# EasyEDA schematic SCH_ultrasound_version2_2023-05-13.json
TITLE: jhz_ultrasound_imaging_version2.0; REV: 1.0; Date: 2023-05-01; Sheet: 1/1; Company: Your Company
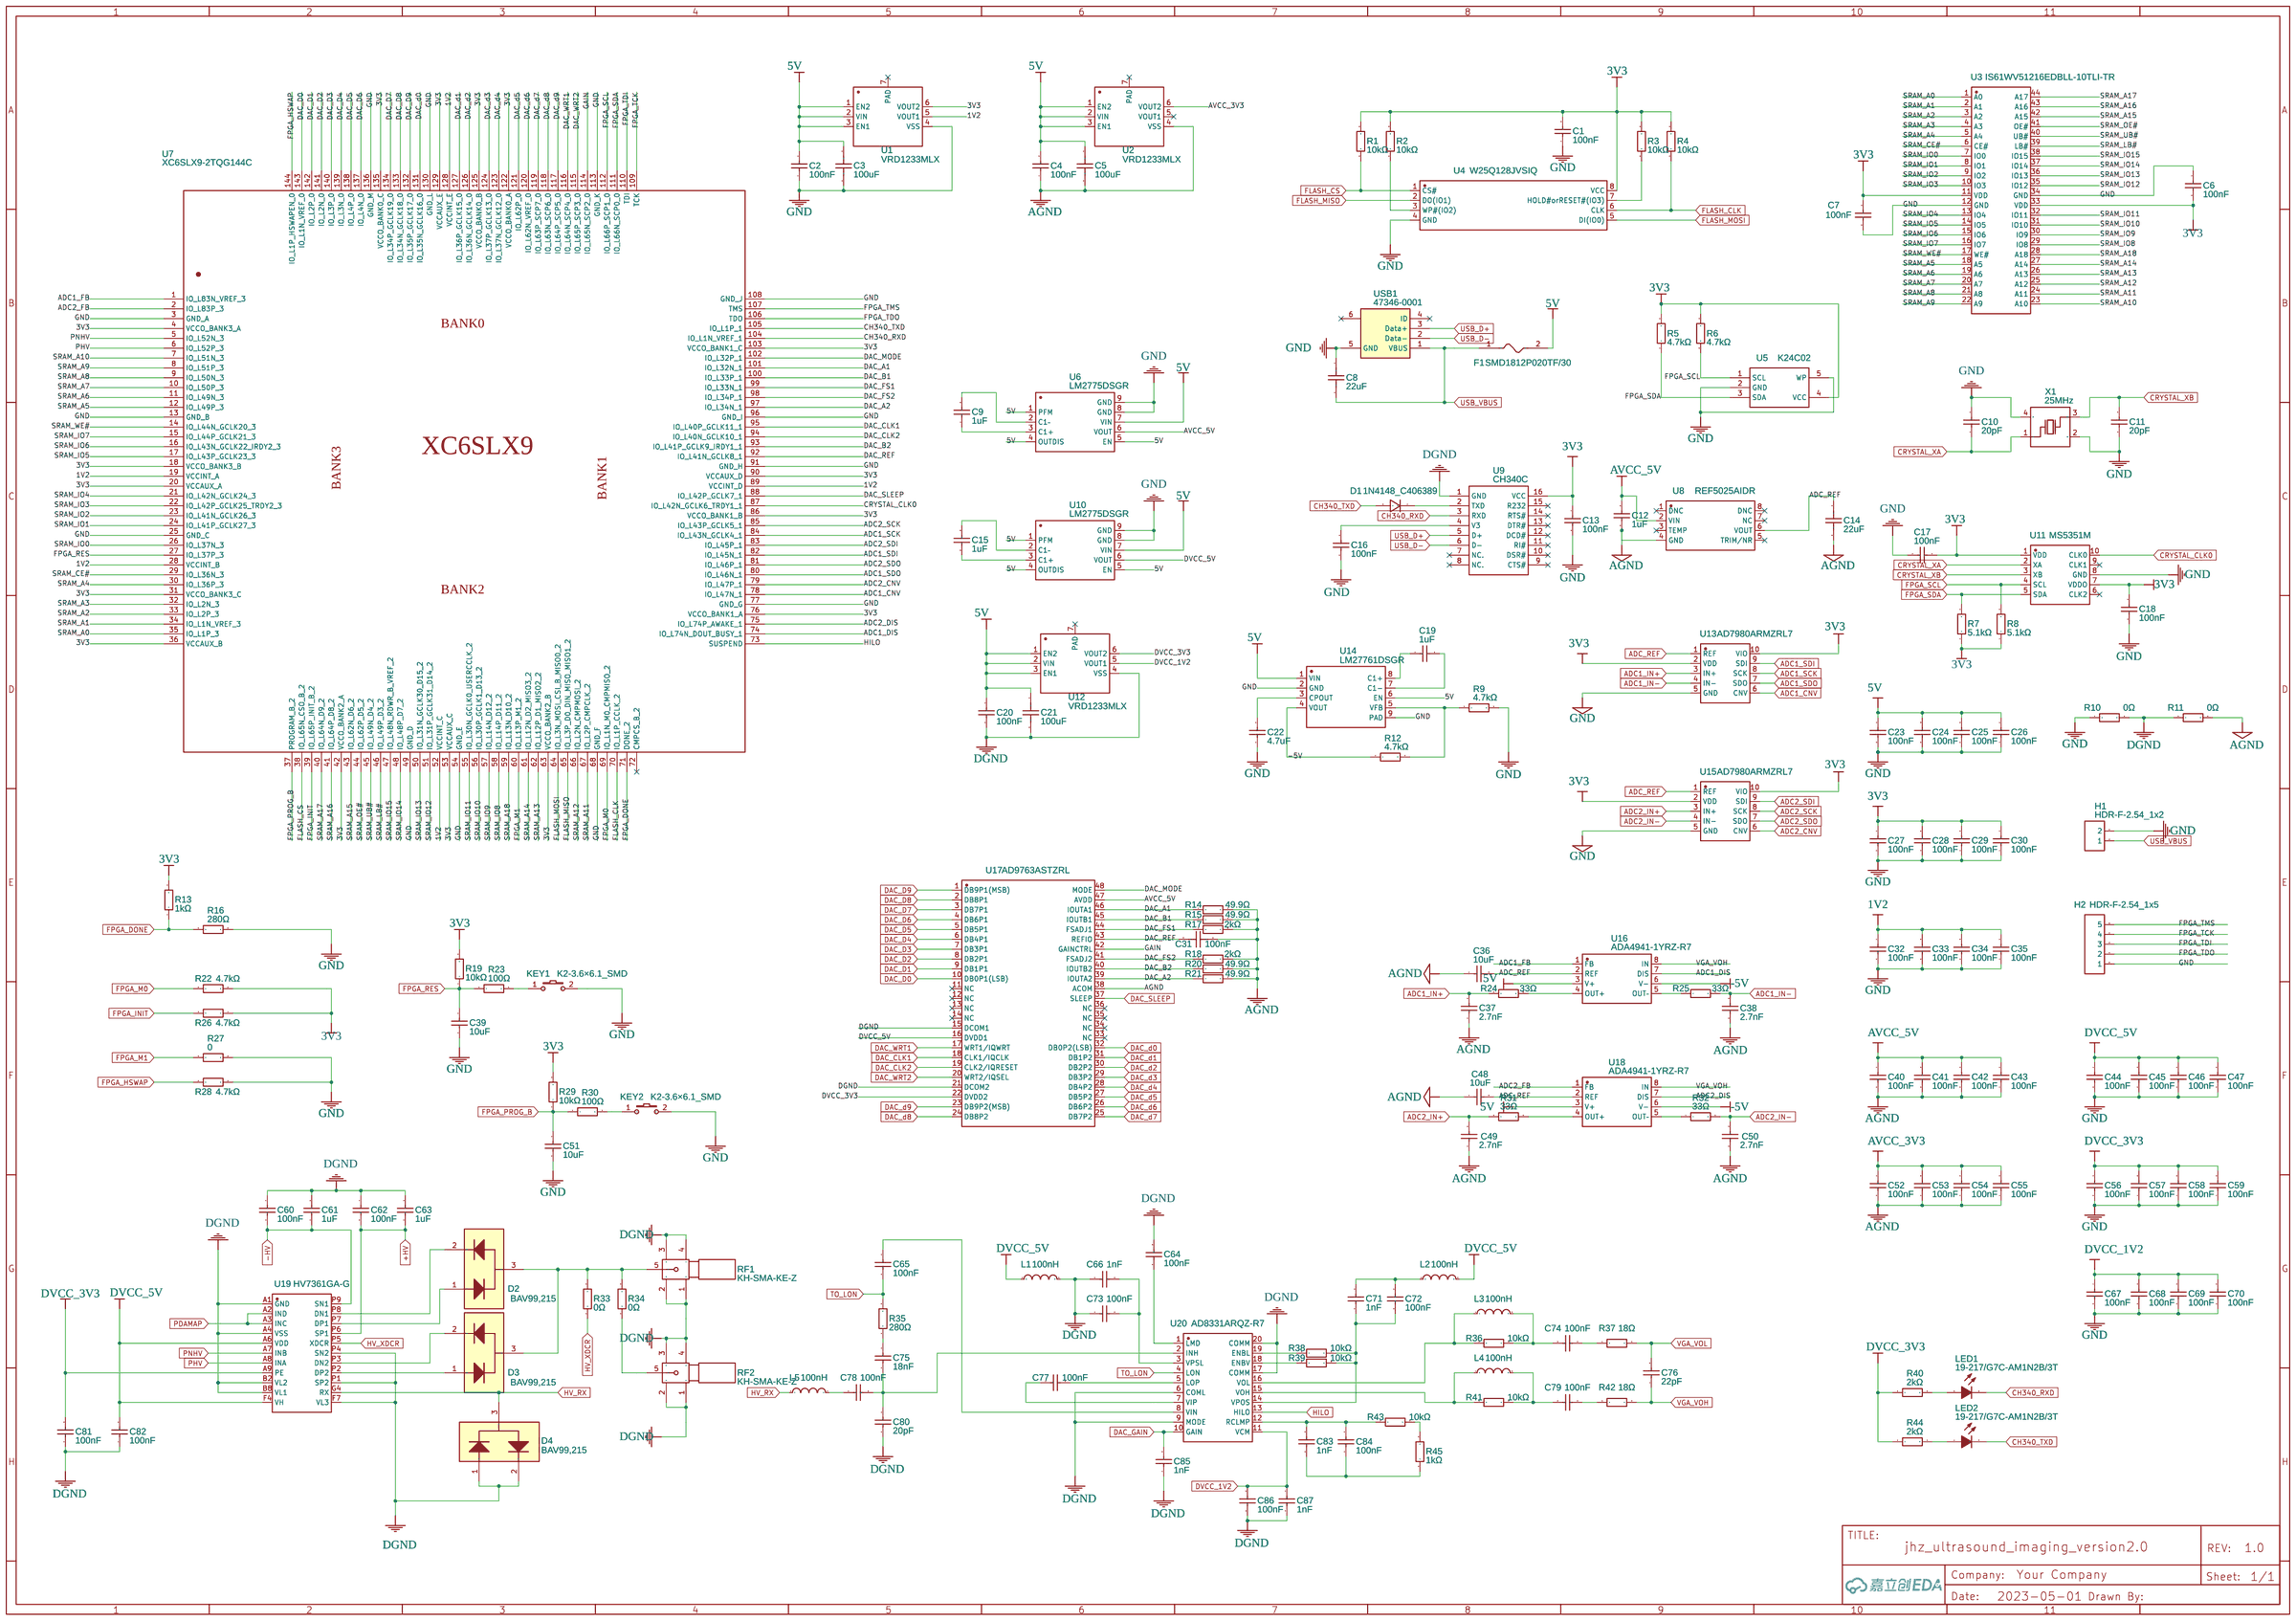
[diagram p0: schematic sheet]

## Parts
C1  100nF  [C0603]
C2  100nF  [C0603]
C3  100uF  [C1206]
C4  100nF  [C0603]
C5  100uF  [C1206]
C6  100nF  [C0603]
C7  100nF  [C0603]
C8  22uF  [C0805]
C9  1uF  [C0603]
C10  20pF  [C0402]
C11  20pF  [C0402]
C12  1uF  [C0603]
C13  100nF  [C0603]
C14  22uF  [C0805]
C15  1uF  [C0603]
C16  100nF  [C0603]
C17  100nF  [C0603]
C18  100nF  [C0603]
C19  1uF  [C0603]
C20  100nF  [C0603]
C21  100uF  [C1206]
C22  4.7uF  [C1206]
C23  100nF  [C0603]
C24  100nF  [C0603]
C25  100nF  [C0603]
C26  100nF  [C0603]
C27  100nF  [C0603]
C28  100nF  [C0603]
C29  100nF  [C0603]
C30  100nF  [C0603]
C31  100nF  [C0603]
C32  100nF  [C0603]
C33  100nF  [C0603]
C34  100nF  [C0603]
C35  100nF  [C0603]
C36  10uF  [C0805]
C37  2.7nF  [C0603]
C38  2.7nF  [C0603]
C39  10uF  [C0805]
C40  100nF  [C0603]
C41  100nF  [C0603]
C42  100nF  [C0603]
C43  100nF  [C0603]
C44  100nF  [C0603]
C45  100nF  [C0603]
C46  100nF  [C0603]
C47  100nF  [C0603]
C48  10uF  [C0805]
C49  2.7nF  [C0603]
C50  2.7nF  [C0603]
C51  10uF  [C0805]
C52  100nF  [C0603]
C53  100nF  [C0603]
C54  100nF  [C0603]
C55  100nF  [C0603]
C56  100nF  [C0603]
C57  100nF  [C0603]
C58  100nF  [C0603]
C59  100nF  [C0603]
C60  100nF  [C0603]
C61  1uF  [C0603]
C62  100nF  [C0603]
C63  1uF  [C0603]
C64  100nF  [C0603]
C65  100nF  [C0603]
C66  1nF  [C1206]
C67  100nF  [C0603]
C68  100nF  [C0603]
C69  100nF  [C0603]
C70  100nF  [C0603]
C71  1nF  [C1206]
C72  100nF  [C0603]
C73  100nF  [C0603]
C74  100nF  [C0603]
C75  18nF  [C0805]
C76  22pF  [C0402]
C77  100nF  [C0603]
C78  100nF  [C0603]
C79  100nF  [C0603]
C80  20pF  [C0402]
C81  100nF  [C0603]
C82  100nF  [C0603]
C83  1nF  [C1206]
C84  100nF  [C0603]
C85  1nF  [C1206]
C86  100nF  [C0603]
C87  1nF  [C1206]
D1  1N4148_C406389  [DO-35_BD2.0-L4.2-P8.20-D0.5-RD]
D2  BAV99,215  [SOT-23-3_L2.9-W1.6-P1.90-LS2.8-BR]
D3  BAV99,215  [SOT-23-3_L2.9-W1.6-P1.90-LS2.8-BR]
D4  BAV99,215  [SOT-23-3_L2.9-W1.6-P1.90-LS2.8-BR]
F1  SMD1812P020TF/30  [F1812]
H1  HDR-F-2.54_1x2  [HDR-F-2.54_1X2]
H2  HDR-F-2.54_1x5  [HDR-F-2.54_1X5]
KEY1  K2-3.6×6.1_SMD  [KEY-SMD_2P-L6.2-W3.6-LS8.0]
KEY2  K2-3.6×6.1_SMD  [KEY-SMD_2P-L6.2-W3.6-LS8.0]
L1  100nH  [L0603]
L2  100nH  [L0603]
L3  100nH  [L0603]
L4  100nH  [L0603]
L5  100nH  [L0603]
LED1  19-217/G7C-AM1N2B/3T  [LED0603-R-RD]
LED2  19-217/G7C-AM1N2B/3T  [LED0603-R-RD]
R1  10kΩ  [R0603]
R2  10kΩ  [R0603]
R3  10kΩ  [R0603]
R4  10kΩ  [R0603]
R5  4.7kΩ  [R0603]
R6  4.7kΩ  [R0603]
R7  5.1kΩ  [R0603]
R8  5.1kΩ  [R0603]
R9  4.7kΩ  [R0603]
R10  0Ω  [R0603]
R11  0Ω  [R0603]
R12  4.7kΩ  [R0603]
R13  1kΩ  [R0603]
R14  49.9Ω  [R0402]
R15  49.9Ω  [R0402]
R16  280Ω  [R0402]
R17  2kΩ  [R0603]
R18  2kΩ  [R0603]
R19  10kΩ  [R0603]
R20  49.9Ω  [R0402]
R21  49.9Ω  [R0402]
R22  4.7kΩ  [R0603]
R23  100Ω  [R0603]
R24  33Ω  [R0402]
R25  33Ω  [R0402]
R26  4.7kΩ  [R0603]
R27  0  [R0603]
R28  4.7kΩ  [R0603]
R29  10kΩ  [R0603]
R30  100Ω  [R0603]
R31  33Ω  [R0402]
R32  33Ω  [R0402]
R33  0Ω  [R0603]
R34  0Ω  [R0603]
R35  280Ω  [R0402]
R36  10kΩ  [R0603]
R37  18Ω  [R0603]
R38  10kΩ  [R0603]
R39  10kΩ  [R0603]
R40  2kΩ  [R0603]
R41  10kΩ  [R0603]
R42  18Ω  [R0603]
R43  10kΩ  [R0603]
R44  2kΩ  [R0603]
R45  1kΩ  [R0603]
RF1  KH-SMA-KE-Z  [SMA-TH_KH-SMA-KE-Z]
RF2  KH-SMA-KE-Z  [SMA-TH_KH-SMA-KE-Z]
U1  VRD1233MLX  [LLP-6_L2.0-W1.8-P0.50-BL-EP]
U2  VRD1233MLX  [LLP-6_L2.0-W1.8-P0.50-BL-EP]
U3  IS61WV51216EDBLL-10TLI-TR  [TSOP-44_L18.4-W10.2-P0.80-LS11.8-BL]
U4  W25Q128JVSIQ  [SOIC-8_L5.3-W5.3-P1.27-LS8.0-BL]
U5  K24C02  [SOT-23-5_L3.0-W1.7-P0.95-LS2.8-BR]
U6  LM2775DSGR  [WSON-8_L2.0-W2.0-P0.50-TL-EP]
U7  XC6SLX9-2TQG144C  [LQFP-144_L20.0-W20.0-P0.50-LS22.0-BL]
U8  REF5025AIDR  [SOIC-8_L4.9-W3.9-P1.27-LS6.0-BL]
U9  CH340C  [SOP-16_L10.0-W3.9-P1.27-LS6.0-BL]
U10  LM2775DSGR  [WSON-8_L2.0-W2.0-P0.50-TL-EP]
U11  MS5351M  [MSOP-10_L3.0-W3.0-P0.50-LS5.0-BL]
U12  VRD1233MLX  [LLP-6_L2.0-W1.8-P0.50-BL-EP]
U13  AD7980ARMZRL7  [MSOP-10_L3.0-W3.0-P0.50-LS5.0-BL]
U14  LM27761DSGR  [WSON-8_L2.0-W2.0-P0.65-BL-EP]
U15  AD7980ARMZRL7  [MSOP-10_L3.0-W3.0-P0.50-LS5.0-BL]
U16  ADA4941-1YRZ-R7  [SOIC-8_L4.9-W3.9-P1.27-LS6.0-BL]
U17  AD9763ASTZRL  [LQFP-48_L7.0-W7.0-P0.50-LS9.0-BL]
U18  ADA4941-1YRZ-R7  [SOIC-8_L4.9-W3.9-P1.27-LS6.0-BL]
U19  HV7361GA-G  [CABGA-22_L5.0-W7.0-TL-HV7361GA-G]
U20  AD8331ARQZ-R7  [QSOP-20_L8.7-W3.9-P0.64-LS6.0-BL]
USB1  47346-0001  [MICRO-USB-SMD_47346-0001]
X1  25MHz  [OSC-SMD_4P-L3.2-W2.5-BL]

## Library data of the parts
C1 C2 C4 C6 C7 C13 C16-C18 C20 C23-C30 C32-C35 C40-C47 C52-C60 C62 C64 C65 C67-C70 C72-C74 C77-C79 C81 C82 C84 C86 = 0603B104K500NT: Supplier: LCSC; Manufacturer: FH(风华); Supplier Part: C30926; JLCPCB Part Class: Extended Part
C3 C5 C21 = 1206X107M6R3NT: Supplier: LCSC; Manufacturer: FH(风华); Contributor: LCSC; Supplier Part: C178304; JLCPCB Part Class: Extended Part
C8 C14 = 0805X226M160NT: Supplier: LCSC; Manufacturer: FH(风华); Contributor: LCSC; Supplier Part: C129302; JLCPCB Part Class: Extended Part
C9 C12 C15 C19 C61 C63 = 0603B105K250NT: Supplier: LCSC; Manufacturer: FH(风华); Supplier Part: C59302; JLCPCB Part Class: Extended Part
C10 C11 C80 = 0402CG200J500NT: Supplier: LCSC; Manufacturer: FH(风华); Supplier Part: C1554; JLCPCB Part Class: Basic Part
C22 = 1206B475K500NT: Supplier: LCSC; Manufacturer: FH(风华); Supplier Part: C29823; JLCPCB Part Class: Basic Part
C31 = C0603B104K500NT: Supplier: LCSC; Supplier Part: C478888; Manufacturer: TORCH(火炬); Contributor: LCSC; JLCPCB Part Class: Extended Part
C36 C39 C48 C51 = 0805X106K250NT: Supplier: LCSC; Manufacturer: FH(风华); Supplier Part: C40894; JLCPCB Part Class: Extended Part
C37 C38 C49 C50 = 0603B272K500NT: Supplier: LCSC; Manufacturer: FH(风华); Supplier Part: C1609; JLCPCB Part Class: Basic Part
C66 C71 C83 C85 C87 = 1206B102K202NT: Supplier: LCSC; Manufacturer: FH(风华); Supplier Part: C9196; JLCPCB Part Class: Basic Part
C75 = 0805B183K500NT: Supplier: LCSC; Manufacturer: FH(风华); Supplier Part: C1723; JLCPCB Part Class: Extended Part
C76 = 0402CG220J500NT: Supplier: LCSC; Manufacturer: FH(风华); Supplier Part: C1555; JLCPCB Part Class: Basic Part
D1 = 1N4148_C406389: Supplier: LCSC; Supplier Part: C406389; Manufacturer: GOOD-ARK(固锝); Manufacturer Part: 1N4148; Contributor: LCSC; JLCPCB Part Class: Extended Part
D2-D4 = BAV99,215: Supplier: LCSC; Manufacturer: Nexperia(安世); Supplier Part: C2500; JLCPCB Part Class: Basic Part
F1 = SMD1812P020TF/30: Supplier: LCSC; Manufacturer: RUILON(瑞隆源); Supplier Part: C13575; JLCPCB Part Class: Extended Part
H1 = HDR-F-2.54_1x2: Supplier Part: C49661; Supplier: LCSC; Contributor: LCEDA_Lib
H2 = HDR-F-2.54_1x5: Supplier Part: C50950; Supplier: LCSC; Contributor: LCEDA_Lib
KEY1 KEY2 = K2-3.6×6.1_SMD: Supplier Part: C118141; Supplier: LCSC; Manufacturer Part: K2-1107ST-A4SW-06; Contributor: LCEDA_Lib; 制造商: 韩国韩荣
L1-L5 = VHF160808HR10JT: Supplier: LCSC; Manufacturer: FH(风华); Supplier Part: C90214; JLCPCB Part Class: Extended Part
LED1 LED2 = 19-217/G7C-AM1N2B/3T: Supplier: LCSC; Supplier Part: C183844; Manufacturer: EVERLIGHT(亿光); Contributor: LCSC; JLCPCB Part Class: Extended Part
R1-R4 R19 R29 R36 R38 R39 R41 R43 = RS-03K1002FT: Supplier: LCSC; Supplier Part: C115324; Manufacturer: FH(风华); Resistance (Ohms): 10K; Contributor: LCSC; JLCPCB Part Class: Extended Part
R5 R6 R9 R12 R22 R26 R28 = RS-03K4701FT: Supplier: LCSC; Manufacturer: FH(风华); Resistance (Ohms): 4.7K; Contributor: LCSC; Supplier Part: C116693; JLCPCB Part Class: Extended Part
R7 R8 = RS-03K5101FT: Supplier: LCSC; Supplier Part: C156350; Manufacturer: FH(风华); Resistance (Ohms): 5.1K; Contributor: LCSC; JLCPCB Part Class: Extended Part
R10 R11 = RS-03000JT_C115304: Supplier: LCSC; Supplier Part: C115304; Manufacturer: FH(风华); Manufacturer Part: RS-03000JT; Resistance (Ohms): 0; Contributor: LCSC; JLCPCB Part Class: Extended Part; Package Display: No
R13 R45 = RS-03K1001FT: Supplier: LCSC; Manufacturer: FH(风华); Supplier Part: C115325; Resistance (Ohms): 1K; JLCPCB Part Class: Extended Part
R14 R15 R20 R21 = RC-02W49R9FT: Supplier: LCSC; Supplier Part: C258106; Manufacturer: FH(风华); Resistance (Ohms): 49.9; Contributor: LCSC; JLCPCB Part Class: Extended Part
R16 R35 = RC-02W2800FT: Supplier: LCSC; Supplier Part: C321421; Manufacturer: FH(风华); Resistance (Ohms): 280; Contributor: LCSC; JLCPCB Part Class: Extended Part
R17 R18 R40 R44 = RS-03K2001FT: Supplier: LCSC; Manufacturer: FH(风华); Supplier Part: C115336; Resistance (Ohms): 2K; JLCPCB Part Class: Extended Part
R23 R30 = RS-03K101JT: Supplier: LCSC; Manufacturer: FH(风华); Supplier Part: C86983; Resistance (Ohms): 100; JLCPCB Part Class: Extended Part
R24 R25 R31 R32 = RC-02W33R0FT: Supplier: LCSC; Supplier Part: C140161; Manufacturer: FH(风华); Resistance (Ohms): 33; Contributor: LCSC; JLCPCB Part Class: Extended Part
R27 = RS-03000JT: Supplier: LCSC; Manufacturer: FH; Supplier Part: C73810; JLCPCB Part Class: Extended Part
R33 R34 = RS-03000JT_C115304: Supplier: LCSC; Supplier Part: C115304; Manufacturer: FH(风华); Manufacturer Part: RS-03000JT; Resistance (Ohms): 0; Contributor: LCSC; JLCPCB Part Class: Extended Part
R37 R42 = RS-03K180JT: Supplier: LCSC; Supplier Part: C286576; Manufacturer: FH(风华); Resistance (Ohms): 18; Contributor: LCSC; JLCPCB Part Class: Extended Part
RF1 RF2 = KH-SMA-KE-Z: Supplier: LCSC; Supplier Part: C504007; Manufacturer: Shenzhen Kinghelm Elec; Contributor: LCSC; JLCPCB Part Class: Extended Part
U1 U2 U12 = VRD1233MLX: Supplier: LCSC; Supplier Part: C697903; Manufacturer: AnaSem(安纳森); Contributor: LCSC; JLCPCB Part Class: Extended Part
U3 = IS61WV51216EDBLL-10TLI-TR: Supplier: LCSC; Supplier Part: C2065273; Manufacturer: ISSI(美国芯成); Contributor: LCSC; JLCPCB Part Class: Extended Part
U4 = W25Q128JVSIQ: Supplier: LCSC; Supplier Part: C113767; Manufacturer: WINBOND(华邦); Contributor: LCSC; JLCPCB Part Class: Extended Part
U5 = K24C02: Supplier: LCSC; Manufacturer: 华虹宏力; Supplier Part: C84964; JLCPCB Part Class: Extended Part
U6 U10 = LM2775DSGR: Supplier: LCSC; Supplier Part: C473361; Manufacturer: TI(德州仪器); Contributor: LCSC; JLCPCB Part Class: Extended Part
U7 = XC6SLX9-2TQG144C: Supplier: LCSC; Manufacturer: XILINX(赛灵思); Supplier Part: C27408; JLCPCB Part Class: Extended Part
U8 = REF5025AIDR: tags: Voltage Reference; Supplier Part: C11341; Supplier: LCSC; Manufacturer: TI(德州仪器); subpart_no: 2; JLCPCB Part Class: Extended Part
U9 = CH340C: Supplier: LCSC; Manufacturer: WCH(南京沁恒); Supplier Part: C84681; JLCPCB Part Class: Extended Part
U11 = MS5351M: Supplier: LCSC; Supplier Part: C1509083; Manufacturer: 杭州瑞盟; Contributor: LCSC; JLCPCB Part Class: Extended Part
U13 U15 = AD7980ARMZRL7: Supplier: LCSC; Supplier Part: C578576; Manufacturer: ADI(亚德诺)/LINEAR(凌特); Contributor: LCSC; JLCPCB Part Class: Extended Part
U14 = LM27761DSGR: Supplier: LCSC; Manufacturer: TI(德州仪器); Supplier Part: C129351; JLCPCB Part Class: Extended Part
U16 U18 = ADA4941-1YRZ-R7: Supplier: LCSC; Supplier Part: C495334; Manufacturer: ADI(亚德诺)/LINEAR(凌特); Contributor: LCSC; JLCPCB Part Class: Extended Part
U17 = AD9763ASTZRL: Supplier: LCSC; Supplier Part: C481891; Manufacturer: ADI(亚德诺)/LINEAR(凌特); Contributor: LCSC; JLCPCB Part Class: Extended Part
U19 = HV7361GA-G: Supplier: LCSC; Supplier Part: C633420; Manufacturer: MICROCHIP(美国微芯); Contributor: LCSC; JLCPCB Part Class: Extended Part
U20 = AD8331ARQZ-R7: Supplier: LCSC; Supplier Part: C578697; Manufacturer: ADI(亚德诺)/LINEAR(凌特); Contributor: LCSC; JLCPCB Part Class: Extended Part
USB1 = 47346-0001: Supplier: LCSC; Supplier Part: C132560; Manufacturer: MOLEX; Manufacturer Part: 473460001; Contributor: LCSC; JLCPCB Part Class: Extended Part
X1 = X322525MOB4SI: Supplier: LCSC; Manufacturer: YXC(扬兴晶振); Supplier Part: C9006; JLCPCB Part Class: Basic Part

## Nets
1V2: C32.1 C33.2 C34.2 C35.2 U1.5(VOUT1) U7.19(VCCINT_A) U7.28(VCCINT_B) U7.52(VCCINT_C) U7.89(VCCINT_D) U7.128(VCCINT_E)
3V3: C1.2 C6.2 C7.2 C13.1 C17.2 C18.2 C27.1 C28.2 C29.2 C30.2 R1.2 R2.2 R3.2 R4.2 R5.2 R6.2 R7.1 R8.1 R13.2 R19.2 R22.2 R26.1 R29.2 U1.6(VOUT2) U3.11(VDD) U3.33(VDD) U4.8(VCC) U5.4(VCC) U7.4(VCCO_BANK3_A) U7.18(VCCO_BANK3_B) U7.20(VCCAUX_A) U7.31(VCCO_BANK3_C) U7.36(VCCAUX_B) U7.42(VCCO_BANK2_A) U7.53(VCCAUX_C) U7.63(VCCO_BANK2_B) U7.76(VCCO_BANK1_A) U7.86(VCCO_BANK1_B) U7.90(VCCAUX_D) U7.103(VCCO_BANK1_C) U7.122(VCCO_BANK0_A) U7.125(VCCO_BANK0_B) U7.129(VCCAUX_E) U7.135(VCCO_BANK0_C) U9.16(VCC) U11.1(VDD) U11.7(VDDO) U13.2(VDD) U13.10(VIO) U15.2(VDD) U15.10(VIO)
5V: C2.2 C3.1 C4.2 C5.1 C20.2 C21.1 C23.1 C24.2 C25.2 C26.2 F1.2 U1.1(EN2) U1.2(VIN) U1.3(EN1) U2.1(EN2) U2.2(VIN) U2.3(EN1) U6.1(PFM) U6.4(OUTDIS) U6.5(EN) U6.7(VIN) U10.1(PFM) U10.4(OUTDIS) U10.5(EN) U10.7(VIN) U12.1(EN2) U12.2(VIN) U12.3(EN1) U14.1(VIN) U14.6(EN) U16.3(V+) U18.3(V+)
-5V: R12.1 U14.4(VOUT) U16.6(V-) U18.6(V-)
AGND: C4.1 C5.2 C12.1 C14.2 C31.2 C36.1 C37.1 C38.1 C40.2 C41.1 C42.1 C43.1 C48.1 C49.1 C50.1 C52.2 C53.1 C54.1 C55.1 R11.2 R14.2 R15.2 R17.2 R18.2 R20.2 R21.2 U2.4(VSS) U8.4(GND) U17.38(ACOM)
AVCC_3V3: C52.1 C53.2 C54.2 C55.2 U2.6(VOUT2)
AVCC_5V: C12.2 C40.1 C41.2 C42.2 C43.2 U6.6(VOUT) U8.2(VIN) U17.47(AVDD)
DGND: C20.1 C21.2 C60.1 C61.2 C62.1 C63.2 C64.2 C66.1 C73.1 C80.1 C81.1 C82.1 C85.1 C86.2 C87.2 D4.1 D4.2 L1.2 R10.2 R11.1 RF1.1 RF1.2 RF1.3 RF1.4 RF2.1 RF2.2 RF2.3 RF2.4 U9.1(GND) U12.4(VSS) U17.15(DCOM1) U17.21(DCOM2) U19.A1(GND) U19.A4(VSS) U19.B2(VL2) U19.B8(VL1) U19.F7(VL3) U19.P1(SP2) U19.P4(SN2) U20.6(COML) U20.9(MODE) U20.17(COMM) U20.20(COMM)
DVCC_1V2: C67.1 C68.2 C69.2 C70.2 C86.1 C87.1 U12.5(VOUT1) U20.11(VCM)
DVCC_3V3: C56.1 C57.2 C58.2 C59.2 C81.2 R40.1 R44.1 U12.6(VOUT2) U17.22(DVDD2) U19.A9(PE)
DVCC_5V: C44.1 C45.2 C46.2 C47.2 C82.2 L1.1 L2.2 U10.6(VOUT) U17.16(DVDD1) U19.A6(VDD) U19.F4(VH)
GND: C1.1 C2.1 C3.2 C6.1 C7.1 C8.1 C10.2 C11.1 C13.2 C16.2 C17.1 C18.1 C22.1 C23.2 C24.1 C25.1 C26.1 C27.2 C28.1 C29.1 C30.1 C32.2 C33.1 C34.1 C35.1 C39.1 C44.2 C45.1 C46.1 C47.1 C51.1 C56.2 C57.1 C58.1 C59.1 C67.2 C68.1 C69.1 C70.1 H1.2 H2.1 KEY1.2 KEY2.2 R9.2 R10.1 R16.2 R27.2 R28.1 U1.4(VSS) U3.12(GND) U3.34(GND) U4.4(GND) U5.2(GND) U5.5(WP) U6.8(GND) U6.9(GND) U7.3(GND_A) U7.13(GND_B) U7.25(GND_C) U7.49(GND_D) U7.54(GND_E) U7.68(GND_F) U7.77(GND_G) U7.91(GND_H) U7.96(GND_I) U7.108(GND_J) U7.113(GND_K) U7.130(GND_L) U7.136(GND_M) U10.8(GND) U10.9(GND) U11.8(GND) U13.5(GND) U14.2(GND) U14.9(PAD) U15.5(GND) USB1.5(GND) X1.2(GND) X1.4(GND)
+HV: C62.2 C63.1 U19.P6(SP1)
-HV: C60.2 C61.1 U19.P9(SN1)
ADC1_CNV: U7.78(IO_L47N_1) U13.6(CNV)
ADC1_DIS: U7.74(IO_L74N_DOUT_BUSY_1) U16.7(DIS)
ADC1_FB: U7.1(IO_L83N_VREF_3) U16.1(FB)
ADC1_IN+: C37.2 R24.1 U13.3(IN+)
ADC1_IN-: C38.2 R25.2 U13.4(IN-)
ADC1_SCK: U7.84(IO_L43N_GCLK4_1) U13.8(SCK)
ADC1_SDI: U7.82(IO_L45N_1) U13.9(SDI)
ADC1_SDO: U7.80(IO_L46N_1) U13.7(SDO)
ADC2_CNV: U7.79(IO_L47P_1) U15.6(CNV)
ADC2_DIS: U7.75(IO_L74P_AWAKE_1) U18.7(DIS)
ADC2_FB: U7.2(IO_L83P_3) U18.1(FB)
ADC2_IN+: C49.2 R31.1 U15.3(IN+)
ADC2_IN-: C50.2 R32.2 U15.4(IN-)
ADC2_SCK: U7.85(IO_L43P_GCLK5_1) U15.8(SCK)
ADC2_SDI: U7.83(IO_L45P_1) U15.9(SDI)
ADC2_SDO: U7.81(IO_L46P_1) U15.7(SDO)
ADC_REF: C14.1 C36.2 C48.2 U8.6(VOUT) U13.1(REF) U15.1(REF) U16.2(REF) U18.2(REF)
CH340_RXD: LED1.2(C) U7.104(IO_L1N_VREF_1) U9.3(RXD)
CH340_TXD: D1.2(A) LED2.2(C) U7.105(IO_L1P_1)
CRYSTAL_CLK0: U7.87(IO_L42N_GCLK6_TRDY1_1) U11.10(CLK0)
CRYSTAL_XA: C10.1 U11.2(XA) X1.1(OSC1)
CRYSTAL_XB: C11.2 U11.3(XB) X1.3(OSC2)
DAC_A1: R14.1 U7.101(IO_L32N_1) U17.46(IOUTA1)
DAC_A2: R21.1 U7.97(IO_L34N_1) U17.39(IOUTA2)
DAC_B1: R15.1 U7.100(IO_L33P_1) U17.45(IOUTB1)
DAC_B2: R20.1 U7.93(IO_L41P_GCLK9_IRDY1_1) U17.40(IOUTB2)
DAC_CLK1: U7.95(IO_L40P_GCLK11_1) U17.18(CLK1/IQCLK)
DAC_CLK2: U7.94(IO_L40N_GCLK10_1) U17.19(CLK2/IQRESET)
DAC_d0: U7.131(IO_L35N_GCLK16_0) U17.32(DB0P2(LSB))
DAC_D0: U7.143(IO_L1N_VREF_0) U17.10(DB0P1(LSB))
DAC_d1: U7.127(IO_L36P_GCLK15_0) U17.31(DB1P2)
DAC_D1: U7.142(IO_L2P_0) U17.9(DB1P1)
DAC_d2: U7.126(IO_L36N_GCLK14_0) U17.30(DB2P2)
DAC_D2: U7.141(IO_L2N_0) U17.8(DB2P1)
DAC_d3: U7.124(IO_L37P_GCLK13_0) U17.29(DB3P2)
DAC_D3: U7.140(IO_L3P_0) U17.7(DB3P1)
DAC_d4: U7.123(IO_L37N_GCLK12_0) U17.28(DB4P2)
DAC_D4: U7.139(IO_L3N_0) U17.6(DB4P1)
DAC_d5: U7.121(IO_L62P_0) U17.27(DB5P2)
DAC_D5: U7.138(IO_L4P_0) U17.5(DB5P1)
DAC_d6: U7.120(IO_L62N_VREF_0) U17.26(DB6P2)
DAC_D6: U7.137(IO_L4N_0) U17.4(DB6P1)
DAC_d7: U7.119(IO_L63P_SCP7_0) U17.25(DB7P2)
DAC_D7: U7.134(IO_L34P_GCLK19_0) U17.3(DB7P1)
DAC_d8: U7.118(IO_L63N_SCP6_0) U17.24(DB8P2)
DAC_D8: U7.133(IO_L34N_GCLK18_0) U17.2(DB8P1)
DAC_d9: U7.117(IO_L64P_SCP5_0) U17.23(DB9P2(MSB))
DAC_D9: U7.132(IO_L35P_GCLK17_0) U17.1(DB9P1(MSB))
DAC_FS1: R17.1 U7.99(IO_L33N_1) U17.44(FSADJ1)
DAC_FS2: R18.1 U7.98(IO_L34P_1) U17.41(FSADJ2)
DAC_GAIN: C85.2 U20.10(GAIN)
DAC_MODE: U7.102(IO_L32P_1) U17.48(MODE)
DAC_REF: C31.1 U7.92(IO_L41N_GCLK8_1) U17.43(REFIO)
DAC_SLEEP: U7.88(IO_L42P_GCLK7_1) U17.37(SLEEP)
DAC_WRT1: U7.116(IO_L64N_SCP4_0) U17.17(WRT1/IQWRT)
DAC_WRT2: U7.115(IO_L65P_SCP3_0) U17.20(WRT2/IQSEL)
FLASH_CLK: R4.1 U4.6(CLK) U7.70(IO_L1P_CCLK_2)
FLASH_CS: R1.1 U4.1(CS#) U7.38(IO_L65N_CSO_B_2)
FLASH_MISO: U4.2(DO(IO1)) U7.65(IO_L3P_D0_DIN_MISO_MISO1_2)
FLASH_MOSI: U4.5(DI(IO0)) U7.64(IO_L3N_MOSI_CSI_B_MISO0_2)
FPGA_DONE: R13.1 R16.1 U7.71(DONE_2)
FPGA_HSWAP: R28.2 U7.144(IO_L1P_HSWAPEN_0)
FPGA_INIT: R26.2 U7.39(IO_L65P_INIT_B_2)
FPGA_M0: R22.1 U7.69(IO_L1N_M0_CMPMISO_2)
FPGA_M1: R27.1 U7.60(IO_L13P_M1_2)
FPGA_PROG_B: C51.2 R29.1 R30.1 U7.37(PROGRAM_B_2)
FPGA_RES: C39.2 R19.1 R23.1 U7.27(IO_L37P_3)
FPGA_SCL: R6.1 R8.2 U5.1(SCL) U7.112(IO_L66P_SCP1_0) U11.4(SCL)
FPGA_SDA: R5.1 R7.2 U5.3(SDA) U7.111(IO_L66N_SCP0_0) U11.5(SDA)
FPGA_TCK: H2.4 U7.109(TCK)
FPGA_TDI: H2.3 U7.110(TDI)
FPGA_TDO: H2.2 U7.106(TDO)
FPGA_TMS: H2.5 U7.107(TMS)
GAIN: U7.114(IO_L65N_SCP2_0) U17.42(GAINCTRL)
HILO: U7.73(SUSPEND) U20.13(HILO)
HV_RX: D4.3 L5.1 U19.G4(RX)
HV_XDCR: R33.1 U19.P5(XDCR)
PDAMAP: U19.A2(IND) U19.A3(INC)
PHV: U7.6(IO_L52P_3) U19.A8(INA)
PNHV: U7.5(IO_L52N_3) U19.A7(INB)
SRAM_A0: U3.1(A0) U7.35(IO_L1P_3)
SRAM_A1: U3.2(A1) U7.34(IO_L1N_VREF_3)
SRAM_A2: U3.3(A2) U7.33(IO_L2P_3)
SRAM_A3: U3.4(A3) U7.32(IO_L2N_3)
SRAM_A4: U3.5(A4) U7.30(IO_L36P_3)
SRAM_A5: U3.18(A5) U7.12(IO_L49P_3)
SRAM_A6: U3.19(A6) U7.11(IO_L49N_3)
SRAM_A7: U3.20(A7) U7.10(IO_L50P_3)
SRAM_A8: U3.21(A8) U7.9(IO_L50N_3)
SRAM_A9: U3.22(A9) U7.8(IO_L51P_3)
SRAM_A10: U3.23(A10) U7.7(IO_L51N_3)
SRAM_A11: U3.24(A11) U7.67(IO_L2P_CMPCLK_2)
SRAM_A12: U3.25(A12) U7.66(IO_L2N_CMPMOSI_2)
SRAM_A13: U3.26(A13) U7.62(IO_L12P_D1_MISO2_2)
SRAM_A14: U3.27(A14) U7.61(IO_L12N_D2_MISO3_2)
SRAM_A15: U3.42(A15) U7.43(IO_L62N_D6_2)
SRAM_A16: U3.43(A16) U7.41(IO_L64P_D8_2)
SRAM_A17: U3.44(A17) U7.40(IO_L64N_D9_2)
SRAM_A18: U3.28(A18) U7.59(IO_L13N_D10_2)
SRAM_CE#: U3.6(CE#) U7.29(IO_L36N_3)
SRAM_IO0: U3.7(IO0) U7.26(IO_L37N_3)
SRAM_IO1: U3.8(IO1) U7.24(IO_L41P_GCLK27_3)
SRAM_IO2: U3.9(IO2) U7.23(IO_L41N_GCLK26_3)
SRAM_IO3: U3.10(IO3) U7.22(IO_L42P_GCLK25_TRDY2_3)
SRAM_IO4: U3.13(IO4) U7.21(IO_L42N_GCLK24_3)
SRAM_IO5: U3.14(IO5) U7.17(IO_L43P_GCLK23_3)
SRAM_IO6: U3.15(IO6) U7.16(IO_L43N_GCLK22_IRDY2_3)
SRAM_IO7: U3.16(IO7) U7.15(IO_L44P_GCLK21_3)
SRAM_IO8: U3.29(IO8) U7.58(IO_L14P_D11_2)
SRAM_IO9: U3.30(IO9) U7.57(IO_L14N_D12_2)
SRAM_IO10: U3.31(IO10) U7.56(IO_L30P_GCLK1_D13_2)
SRAM_IO11: U3.32(IO11) U7.55(IO_L30N_GCLK0_USERCCLK_2)
SRAM_IO12: U3.35(IO12) U7.51(IO_L31P_GCLK31_D14_2)
SRAM_IO13: U3.36(IO13) U7.50(IO_L31N_GCLK30_D15_2)
SRAM_IO14: U3.37(IO14) U7.48(IO_L48P_D7_2)
SRAM_IO15: U3.38(IO15) U7.47(IO_L48N_RDWR_B_VREF_2)
SRAM_LB#: U3.39(LB#) U7.46(IO_L49P_D3_2)
SRAM_OE#: U3.41(OE#) U7.44(IO_L62P_D5_2)
SRAM_UB#: U3.40(UB#) U7.45(IO_L49N_D4_2)
SRAM_WE#: U3.17(WE#) U7.14(IO_L44N_GCLK20_3)
TO_LON: C65.1 R35.2 U20.4(LON)
USB_D+: U9.5(D+) USB1.3(Data+)
USB_D-: U9.6(D-) USB1.2(Data-)
USB_VBUS: C8.2 F1.1 H1.1 USB1.1(VBUS)
VGA_VOH: C76.1 R42.2 U16.8(IN) U18.8(IN)
VGA_VOL: C76.2 R37.2
Net-(C9-1): C9.1 U6.3(C1+)
Net-(C9-2): C9.2 U6.2(C1–)
Net-(C15-1): C15.1 U10.3(C1+)
Net-(C15-2): C15.2 U10.2(C1–)
Net-(C16-1): C16.1 U9.4(V3)
Net-(C19-1): C19.1 U14.8(C1+)
Net-(C19-2): C19.2 U14.7(C1-)
Net-(C22-2): C22.2 U14.3(CPOUT)
Net-(C64-1): C64.1 U20.1(LMD)
Net-(C65-2): C65.2 U20.8(VIN)
Net-(C66-2): C66.2 C73.2 U20.3(VPSL)
Net-(C71-1): C71.1 C72.1 R38.2 R39.2 U20.14(VPOS)
Net-(C71-2): C71.2 C72.2 L2.1
Net-(C74-1): C74.1 R37.1
Net-(C74-2): C74.2 L3.2 R36.2
Net-(C75-1): C75.1 C78.2 C80.2 U20.2(INH)
Net-(C75-2): C75.2 R35.1
Net-(C77-1): C77.1 U20.7(VIP)
Net-(C77-2): C77.2 U20.5(LOP)
Net-(C78-1): C78.1 L5.2
Net-(C79-1): C79.1 R42.1
Net-(C79-2): C79.2 L4.2 R41.2
Net-(C83-1): C83.1 C84.1 R45.1
Net-(C83-2): C83.2 C84.2 R43.1 U20.12(RCLMP)
Net-(D1-1): D1.1(C) U9.2(TXD)
Net-(D2-1): D2.1 U19.P7(DP1)
Net-(D2-2): D2.2 U19.P8(DN1)
Net-(D2-3): D2.3 D3.3 R33.2 R34.2 RF1.5
Net-(D3-1): D3.1 U19.P2(DP2)
Net-(D3-2): D3.2 U19.P3(DN2)
Net-(KEY1-1): KEY1.1 R23.2
Net-(KEY2-1): KEY2.1 R30.2
Net-(L3-1): L3.1 R36.1 U20.16(VOL)
Net-(L4-1): L4.1 R41.1 U20.15(VOH)
Net-(LED1-1): LED1.1(A) R40.2
Net-(LED2-1): LED2.1(A) R44.2
Net-(R2-1): R2.1 U4.3(WP#(IO2))
Net-(R3-1): R3.1 U4.7(HOLD#orRESET#(IO3))
Net-(R9-1): R9.1 R12.2 U14.5(VFB)
Net-(R24-2): R24.2 U16.4(OUT+)
Net-(R25-1): R25.1 U16.5(OUT–)
Net-(R31-2): R31.2 U18.4(OUT+)
Net-(R32-1): R32.1 U18.5(OUT–)
Net-(R34-1): R34.1 RF2.5
Net-(R38-1): R38.1 U20.19(ENBL)
Net-(R39-1): R39.1 U20.18(ENBV)
Net-(R43-2): R43.2 R45.2

Not connected (* = marked no-connect by the designer): U1 7(PAD)*; U2 5(VOUT1)* 7(PAD)*; U7 72(CMPCS_B_2)*; U8 1(DNC)* 3(TEMP)* 5(TRIM/NR)* 7(NC)* 8(DNC)*; U9 7(NC.)* 8(NC.)* 9(CTS#)* 10(DSR#)* 11(RI#)* 12(DCD#)* 13(DTR#)* 14(RTS#)* 15(R232)*; U11 6(CLK2)* 9(CLK1)*; U12 7(PAD)*; U17 11(NC)* 12(NC)* 13(NC)* 14(NC)* 33(NC)* 34(NC)* 35(NC)* 36(NC)*; USB1 4(ID)* 6*
